# Altium schematic sheet SmartChess_SCH.SchDoc
size B
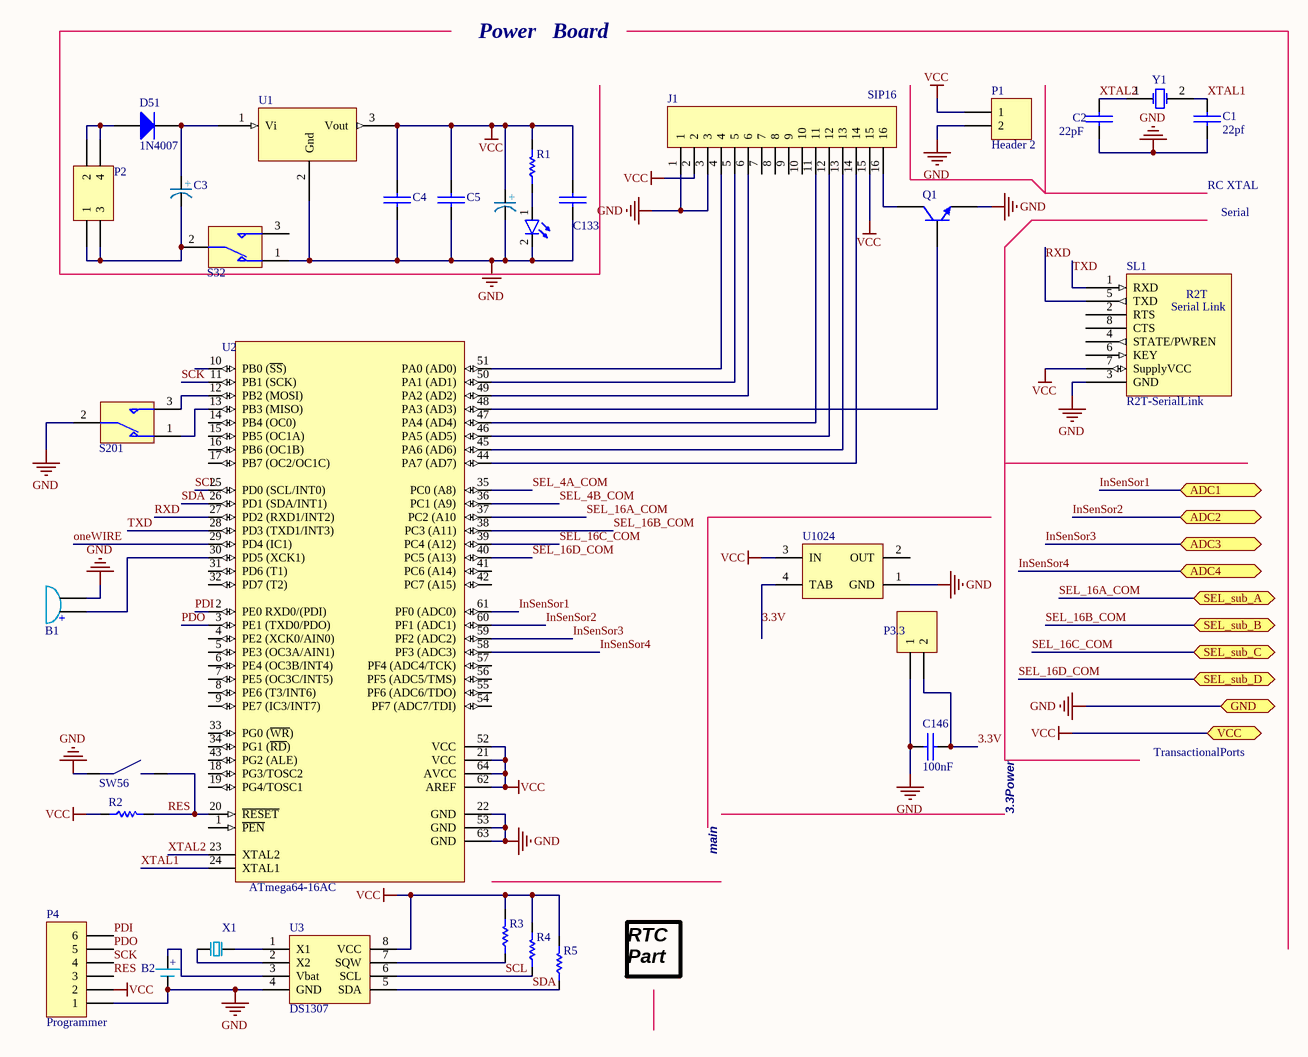
[diagram p0: SmartChess_SCH.SchDoc]

## Parts
B1  Buzzer  [Buzzer]  (value not drawn)
B2  BAT  [BAT_H]  (value not drawn)
C1  22pf  [SMD_CAP_1206]
C2  22pF  [SMD_CAP_1206]
C3  Capacitor Polarized  [Electrolytic Capacitor SMD Dia-8]  (value not drawn)
C4  100nF  [SMD_CAP_1206]  (value not drawn)
C5  300nf  [SMD_CAP_1206]  (value not drawn)
C9  Capacitor Polarized  [Electrolytic Capacitor SMD Dia-8]  (value not drawn)
C133  100pF  [SMD_CAP_1206]  (value not drawn)
C146  100nF  [SMD_CAP_1206]
D51  1N4007  [My_DO-41]
J1  SIP16  [SIP16]
LED1  Red  [LED SMD 1206]  (value not drawn)
P1  Header 2  [HDR1X2]
P2  Header 2X2  [HDR2X2]  (value not drawn)
P3.3  Header 2  [HDR1X2]  (value not drawn)
P4  Programmer  [HDR1X6]
Q1  C945  [C945]  (value not drawn)
R1  330  [RES 0805 (2012X06L)]  (value not drawn)
R2  1K  [RES 0805 (2012X06L)]  (value not drawn)
R3  1K  [RES 0805 (2012X06L)]  (value not drawn)
R4  1K  [RES 0805 (2012X06L)]  (value not drawn)
R5  1K  [RES 0805 (2012X06L)]  (value not drawn)
S32  Switch SPDT_Subminiator  [SPDT Subminiator]  (value not drawn)
S201  Switch SPDT_Subminiator  [SPDT Subminiator]  (value not drawn)
SL1  R2T-SerialLink  [Bluetooth Serial]
SW56  SWITCH  [SWITCH]  (value not drawn)
U1  78M05  [DPAK228P972X240-3N]  (value not drawn)
U2  ATmega64-16AC  [64A_N]
U3  DS1307  [DIP8]
U1024  LM1117IMP-x.x  [MP04A_N]  (value not drawn)
X1  XTAL  [XTAL2]  (value not drawn)
Y1  8Mhz  [Crystal SMD]  (value not drawn)

## Ports
ADC1 (bidir), ADC2 (bidir), ADC3 (bidir), ADC4 (bidir), GND (bidir), SEL_sub_A (bidir), SEL_sub_B (bidir), SEL_sub_C (bidir), SEL_sub_D (bidir), VCC (bidir)

## Nets
GND: B1.2(GND) B2.2 C1.2(-) C2.2(-) C4.2(-) C5.2(-) C9.2 C133.2(-) C146.1(+) J1.1 J1.3 LED1.2(K) P1.2 P3.3.1 P4.1 Q1.1(E) S32.1 S201.2 SL1.3(GND) SW56.1 U1.2(Gnd) U2.22(GND) U2.53(GND) U2.63(GND) U3.4(GND) U1024.1(GND) ; port GND
VCC: C4.1(+) C5.1(+) C9.1 C133.1(+) J1.2 J1.15 P1.1 P4.2 R1.2 R2.1 R3.2 R4.2 R5.2 SL1.7(SupplyVCC) U1.3(Vout) U2.21(VCC) U2.52(VCC) U2.62(AREF) U2.64(AVCC) U3.8(VCC) U1024.3(IN) ; port VCC
3.3V: C146.2(-) P3.3.2 U1024.4(TAB)
InSenSor1: U2.61(PF0_(ADC0)) ; port ADC1
InSenSor2: U2.60(PF1_(ADC1)) ; port ADC2
InSenSor3: U2.59(PF2_(ADC2)) ; port ADC3
InSenSor4: U2.58(PF3_(ADC3)) ; port ADC4
oneWIRE: U2.29(PD4_(IC1))
PDI: P4.6 U2.2(PE0_RXD0/(PDI))
PDO: P4.5 U2.3(PE1_(TXD0/PDO))
RES: P4.3 R2.2 SW56.2 U2.20(~{RESET})
RXD: SL1.5(TXD) U2.27(PD2_(RXD1/INT2))
SCK: P4.4 U2.11(PB1_(SCK))
SCL: R4.1 U2.25(PD0_(SCL/INT0)) U3.6(SCL)
SDA: R5.1 U2.26(PD1_(SDA/INT1)) U3.5(SDA)
SEL_4A_COM: U2.35(PC0_(A8))
SEL_4B_COM: U2.36(PC1_(A9))
SEL_16A_COM: U2.37(PC2_(A10) ; port SEL_sub_A
SEL_16B_COM: U2.38(PC3_(A11)) ; port SEL_sub_B
SEL_16C_COM: U2.39(PC4_(A12)) ; port SEL_sub_C
SEL_16D_COM: U2.40(PC5_(A13)) ; port SEL_sub_D
TXD: SL1.1(RXD) U2.28(PD3_(TXD1/INT3))
XTAL1: C1.1(+) U2.24(XTAL1) Y1.2(OSC2)
XTAL2: C2.1(+) U2.23(XTAL2) Y1.1(OSC1)
NetB1_1: B1.1(VCC) U2.30(PD5_(XCK1))
NetB2_1: B2.1 U3.3(Vbat)
NetC3_1: C3.1 D51.K U1.1(Vi)
NetC3_2: C3.2 P2.1 P2.3 S32.2
NetD51_A: D51.A P2.2 P2.4
NetJ1_4: J1.4 U2.51(PA0_(AD0))
NetJ1_5: J1.5 U2.50(PA1_(AD1))
NetJ1_6: J1.6 U2.49(PA2_(AD2))
NetJ1_11: J1.11 U2.47(PA4_(AD4))
NetJ1_12: J1.12 U2.46(PA5_(AD5))
NetJ1_13: J1.13 U2.45(PA6_(AD6))
NetJ1_14: J1.14 U2.44(PA7_(AD7))
NetJ1_16: J1.16 Q1.2(C)
NetLED1_1: LED1.1(A) R1.1
NetQ1_3: Q1.3(B) U2.48(PA3_(AD3))
NetR3_1: R3.1 U3.7(SQW)
NetS201_1: S201.1 U2.13(PB3_(MISO))
NetS201_3: S201.3 U2.12(PB2_(MOSI))
NetU3_1: U3.1(X1) X1.1
NetU3_2: U3.2(X2) X1.2

Not connected (* = marked no-connect by the designer): J1 7 8 9 10; S32 3; SL1 2(RTS) 4(STATE/PWREN) 6(KEY) 8(CTS); U2 1(~{PEN}) 4(PE2_(XCK0/AIN0)) 5(PE3_(OC3A/AIN1)) 6(PE4_(OC3B/INT4)) 7(PE5_(OC3C/INT5)) 8(PE6_(T3/INT6)) 9(PE7_(IC3/INT7)) 10(PB0_(~{SS})) 14(PB4_(OC0)) 15(PB5_(OC1A)) 16(PB6_(OC1B)) 17(PB7_(OC2/OC1C)) 18(PG3/TOSC2) 19(PG4/TOSC1) 31(PD6_(T1)) 32(PD7_(T2)) 33(PG0_(~{WR})) 34(PG1_(~{RD})) 41(PC6_(A14)) 42(PC7_(A15)) 43(PG2_(ALE)) 54(PF7_(ADC7/TDI)) 55(PF6_(ADC6/TDO)) 56(PF5_(ADC5/TMS)) 57(PF4_(ADC4/TCK)); U1024 2(OUT)

## Notes on the sheet
- Power   Board
- RC XTAL
- Serial
- 3.3Power
- TransactionalPorts
- main
- RTC Part
- (in symbol BAT) +
- (in symbol Buzzer) +
- (in symbol Capacitor Polarized) +
- (in symbol R2T-SerialLink) R2T; Serial Link

## Library data of the parts
B1 = Buzzer: Designer: Hamed Jafarzadeh
C1 C2 C4 C5 C133 C146 = Cap-Bipolar: Bipolar Capacitor; Voltage: 100V; Designer: Saeid Jorablo; Organazation: ControTec; Adding Date: 1387/12/20
  C1: Value: 22pf
  C2: Value: 22pF
  C4 C146: Value: 100nF
  C5: Value: 300nf
  C133: Value: 100pF
C3 C9 = Capacitor Polarized: Designer: Hamed Jafarzadeh ( R2T ); Description:: 470uf,16v
D51 = 1N4007: 1 Amp Diode
LED1 = LED: Designer: Saeid Jorablo; Organazation: ControTec; Adding Date: 1387/12/22; Color: Red; Size: SMD 1206
P1 P3.3 = Header 2: Header, 2-Pin; LatestRevisionDate: 17-Jul-2002; LatestRevisionNote: Re-released for DXP Platform.; Publisher: Altium Limited
P2 = Header 2X2: Header, 2-Pin, Dual row; LatestRevisionDate: 17-Jul-2002; LatestRevisionNote: Re-released for DXP Platform.; Publisher: Altium Limited
P4 = Header 6: Header, 6-Pin; LatestRevisionDate: 17-Jul-2002; LatestRevisionNote: Re-released for DXP Platform.; Publisher: Altium Limited
Q1 = C945: NPN Transistor; Designer: Saeid Jorablo; Company: IPA CO; Last Update Time: 2008/08/04; Value: C945
R1-R5 = Resistor: Tolerance: 5%; Power: 1/8 W
  R1: Value: 330
  R2-R5: Value: 1K
S32 S201 = Switch SPDT_Subminiator: Subminiator SPDT Switch; Company: E.P.I.L; Design date: 2011/11/02
SL1 = R2T-SerialLink: Caution: It is specially design for our Serial Wireless link - 09362688949; Designer: Hamed Jafarzadeh-WWW.R2T.IR
U2 = ATmega64-16AC: 8-Bit AVR Microcontroller with 64K Bytes of In-System Programmable Flash Memory; Published: 17-Sep-2003; LatestRevisionDate: 13-Apr-2006; LatestRevisionNote: IPC-7351 Footprint Added.; DatasheetVersion: 2490C-AVR-009/02; PackageVersion: revB, Oct-2001; PackageReference: 64A; Publisher: Altium Limited; PackageDescription: 64-Pin Thin Quad Flat Pack 0.8 mm Pitch; Code_JEDEC: MS-026-AEB; ComponentLink1Description: Manufacturer Link; ComponentLink1URL: http://www.atmel.com; ComponentLink2Description: Datasheet; ComponentLink2URL: http://www.atmel.com/dyn/resources/prod_documents/doc2490.pdf
U1024 = LM1117IMP-x.x: x.x Volt, 800mA Low-Dropout Linear Regulator, 4-pin SOT-223; PartNumber: LM1117IMP-3.3; Manufacturer: National Semiconductor; PackageTopMarking: XYTT*N05B; PowerWise: N; CompType: LDO IC; Published: 4-Dec-2008; DatasheetVersion: Apr-2006; PackageVersion: revB, Apr-2003; PackageReference: MP04A; Publisher: Altium Limited; PackageDescription: Molded SOT-223, 6.50 x 3.56 x 1.6mm Body, 4 Lead, 2.3mm Pitch; Supplier 1: Farnell; Supplier Part Number 1: 7614123; RoHS: N; PinCount: 4; Code_JEDEC: TO-261-AA; Code_IPC: SOT223-4; ComponentLink1Description: LM1117 Datasheet; ComponentLink1URL: http://www.national.com/ds/LM/LM1117.pdf; ComponentLink2Description: LM1117 Web Page; ComponentLink2URL: http://www.national.com/pf/LM/LM1117.html; ComponentLink3Description: MP04A Package Page; ComponentLink3URL: http://www.national.com/packaging/folders/mp04a.html
Y1 = XTAL: XTAL Crystal; Company: E.P.I.L; Design Date: 11/04/2011; Value: 8Mhz